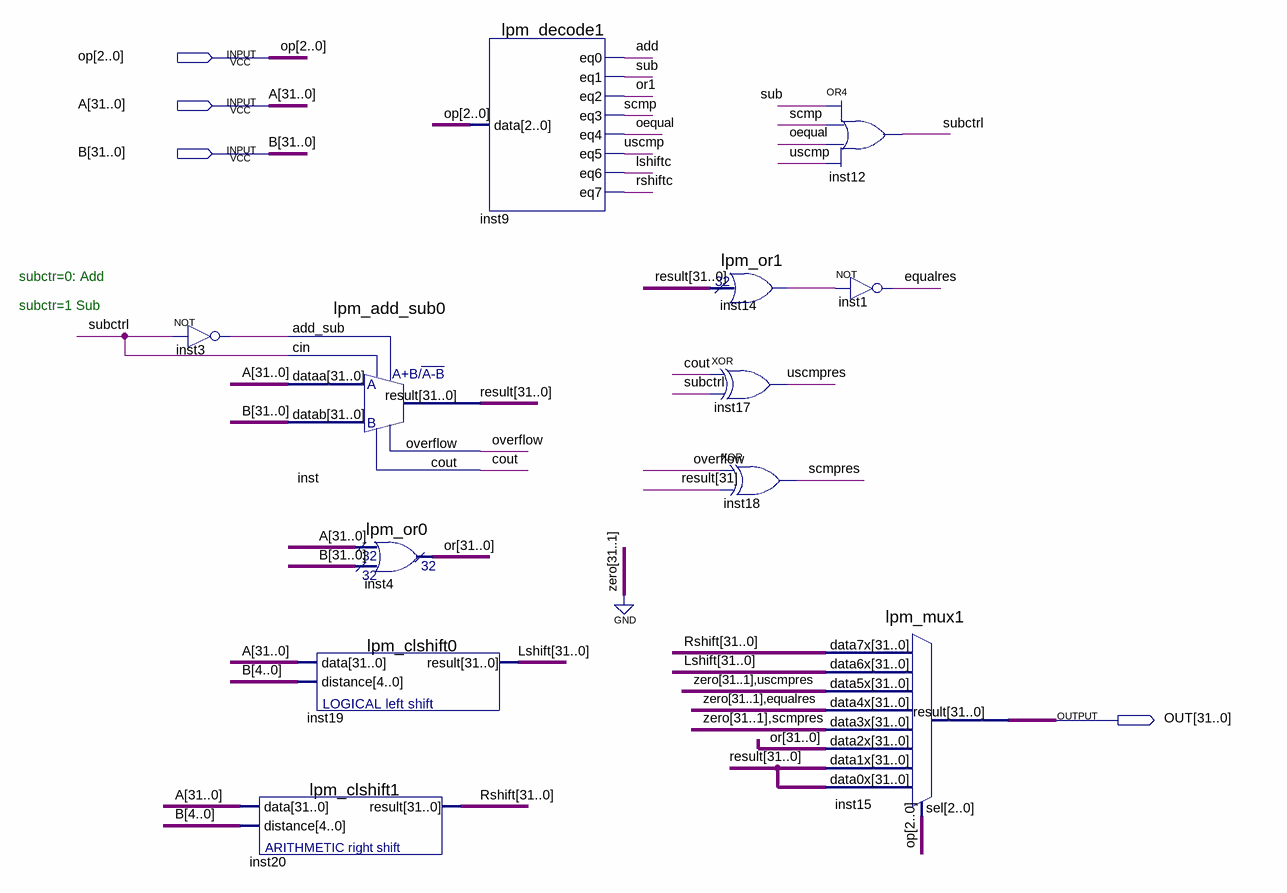
[diagram p0: schematic sheet]
// Quartus schematic ALU.bdf as structural Verilog: 12 symbols, 4 pins
module ALU (
  input  [2:0] op,
  input  [31:0] A,
  input  [31:0] B,
  output [31:0] OUT
);

  wire add, cout, equalres, inst3_out, inst14_result, lshiftc, oequal, overflow, rshiftc, scmp, scmpres, sub,
       subctrl, uscmp, uscmpres;
  wire [31:0] Lshift, \or , result, Rshift;

  not inst3 (inst3_out, subctrl);
  lpm_add_sub0 inst (
    .dataa(A), .datab(B), .add_sub(inst3_out), .cin(subctrl), .result(result), .overflow(overflow),
    .cout(cout));
  lpm_clshift1 inst20 (.data(A), .distance(B[4:0]), .result(Rshift));
  lpm_or0 inst4 (.data0x(A), .data1x(B), .result(\or ));
  lpm_clshift0 inst19 (.data(A), .distance(B[4:0]), .result(Lshift));
  lpm_decode1 inst9 (
    .data(op), .eq0(add), .eq1(sub), .eq2(\or [1]), .eq3(scmp), .eq4(oequal), .eq5(uscmp), .eq6(lshiftc),
    .eq7(rshiftc));
  lpm_or1 inst14 (.data(result), .result(inst14_result));
  xor inst17 (uscmpres, cout, subctrl);
  xor inst18 (scmpres, overflow, result[31]);
  or inst12 (subctrl, sub, scmp, oequal, uscmp);
  lpm_mux1 inst15 (
    .data7x(Rshift), .data6x(Lshift), .data5x({{31{1'b0}}, uscmpres}), .data4x({{31{1'b0}}, equalres}),
    .data3x({{31{1'b0}}, scmpres}), .data2x(\or ), .data1x(result), .data0x(result), .sel(op), .result(OUT));
  not inst1 (equalres, inst14_result);

  // Notes on the sheet:
  //   subctr=0: Add
  //   subctr=1 Sub
endmodule
